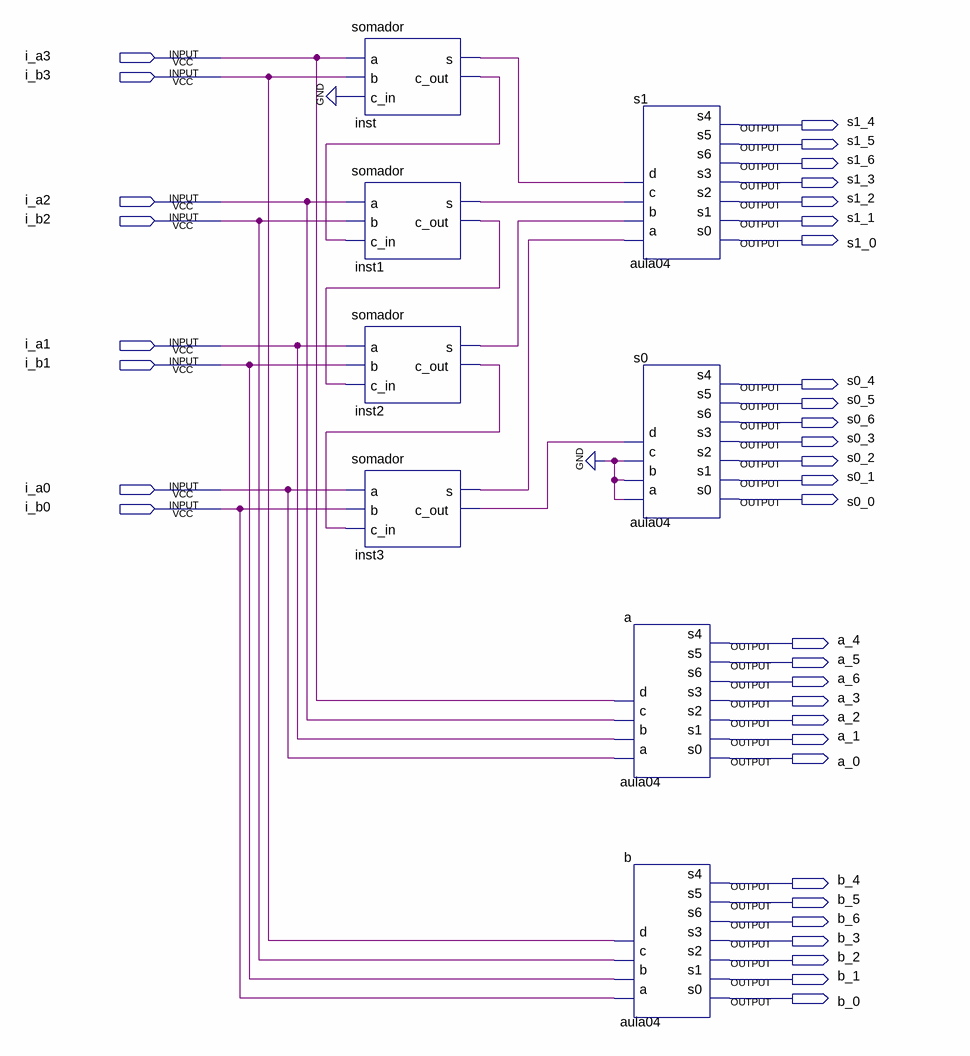
[diagram p0: schematic sheet]
// Quartus schematic aula06.bdf as structural Verilog: 8 symbols, 36 pins
module aula06 (
  input  i_a3,
  input  i_b3,
  input  i_a2,
  input  i_b2,
  input  i_a1,
  input  i_b1,
  input  i_a0,
  input  i_b0,
  output s1_4,
  output s1_5,
  output s1_6,
  output s1_3,
  output s1_2,
  output s1_1,
  output s1_0,
  output s0_4,
  output s0_5,
  output s0_6,
  output s0_3,
  output s0_2,
  output s0_1,
  output s0_0,
  output a_4,
  output a_5,
  output a_6,
  output a_3,
  output a_2,
  output a_1,
  output a_0,
  output b_4,
  output b_5,
  output b_6,
  output b_3,
  output b_2,
  output b_1,
  output b_0
);

  wire inst1_c_out, inst1_s, inst2_c_out, inst2_s, inst3_c_out, inst3_s, inst_c_out, inst_s;

  somador inst (.a(i_a3), .b(i_b3), .c_in(1'b0), .s(inst_s), .c_out(inst_c_out));
  somador inst1 (.a(i_a2), .b(i_b2), .c_in(inst_c_out), .s(inst1_s), .c_out(inst1_c_out));
  somador inst2 (.a(i_a1), .b(i_b1), .c_in(inst1_c_out), .s(inst2_s), .c_out(inst2_c_out));
  somador inst3 (.a(i_a0), .b(i_b0), .c_in(inst2_c_out), .s(inst3_s), .c_out(inst3_c_out));
  aula04 s1 (
    .a(inst3_s), .b(inst2_s), .c(inst1_s), .d(inst_s), .s0(s1_0), .s1(s1_1), .s2(s1_2), .s3(s1_3), .s6(s1_6),
    .s5(s1_5), .s4(s1_4));
  aula04 s0 (
    .a(1'b0), .b(1'b0), .c(1'b0), .d(inst3_c_out), .s0(s0_0), .s1(s0_1), .s2(s0_2), .s3(s0_3), .s6(s0_6),
    .s5(s0_5), .s4(s0_4));
  aula04 a (
    .a(i_a0), .b(i_a1), .c(i_a2), .d(i_a3), .s0(a_0), .s1(a_1), .s2(a_2), .s3(a_3), .s6(a_6), .s5(a_5),
    .s4(a_4));
  aula04 b (
    .a(i_b0), .b(i_b1), .c(i_b2), .d(i_b3), .s0(b_0), .s1(b_1), .s2(b_2), .s3(b_3), .s6(b_6), .s5(b_5),
    .s4(b_4));
endmodule
